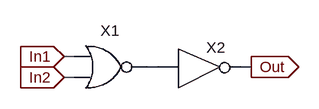
[diagram p0: schematic OR2.asc]
OR2.asc, the LTspice schematic file:
Version 4
SHEET 1 1136 680
WIRE 384 256 368 256
WIRE 512 272 496 272
WIRE 656 272 640 272
WIRE 384 288 368 288
FLAG 656 272 Out
IOPIN 656 272 Out
FLAG 368 256 In1
IOPIN 368 256 In
FLAG 368 288 In2
IOPIN 368 288 In
SYMBOL NOR2 432 208 R0
SYMATTR InstName X1
SYMBOL NOT 544 240 R0
SYMATTR InstName X2

The netlist it stands for:
* OR2.asc
XX1 In1 In2 N001 NOR2  ; pins In1 In2 Out
XX2 N001 Out NOT  ; pins In Out
.backanno
.end